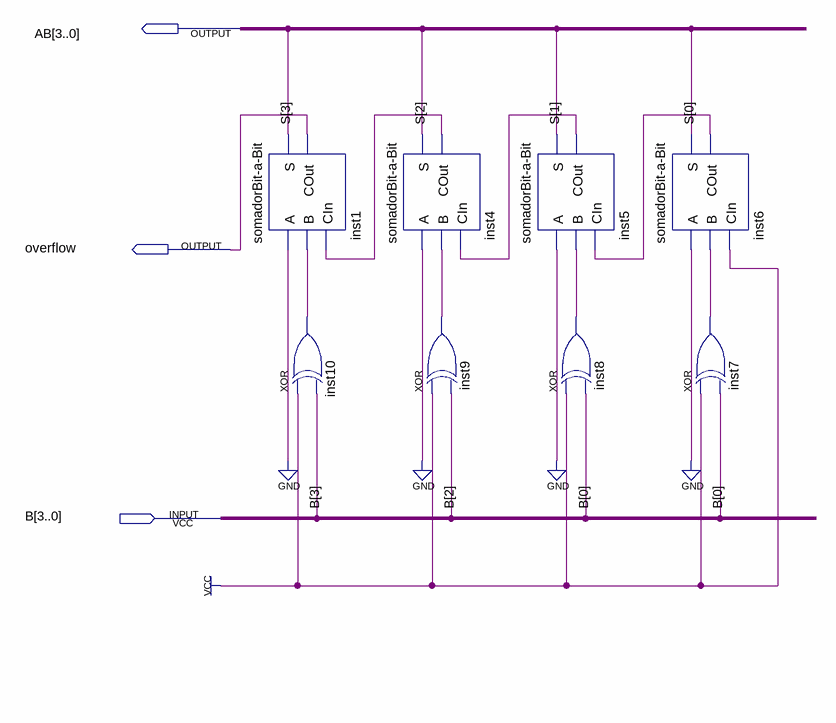
[diagram p0: schematic sheet]
// Quartus schematic Complemento2.bdf as structural Verilog: 8 symbols, 3 pins
module Complemento2 (
  input  [3:0] B,
  output [3:0] AB,
  output overflow
);

  wire inst4_cout, inst5_cout, inst6_cout, inst7_out, inst8_out, inst9_out, inst10_out;
  wire [3:0] S;

  \somadorBit-a-Bit  inst1 (.A(1'b0), .B(inst10_out), .CIn(inst4_cout), .S(S[3]), .COut(overflow));
  xor inst10 (inst10_out, 1'b1, B[3]);
  \somadorBit-a-Bit  inst4 (.A(1'b0), .B(inst9_out), .CIn(inst5_cout), .S(S[2]), .COut(inst4_cout));
  xor inst9 (inst9_out, 1'b1, B[2]);
  \somadorBit-a-Bit  inst5 (.A(1'b0), .B(inst8_out), .CIn(inst6_cout), .S(S[1]), .COut(inst5_cout));
  xor inst8 (inst8_out, 1'b1, B[0]);
  \somadorBit-a-Bit  inst6 (.A(1'b0), .B(inst7_out), .CIn(1'b1), .S(S[0]), .COut(inst6_cout));
  xor inst7 (inst7_out, 1'b1, B[0]);
endmodule
